# Altium schematic sheet PI485_SAMPLE.SchDoc
size A4
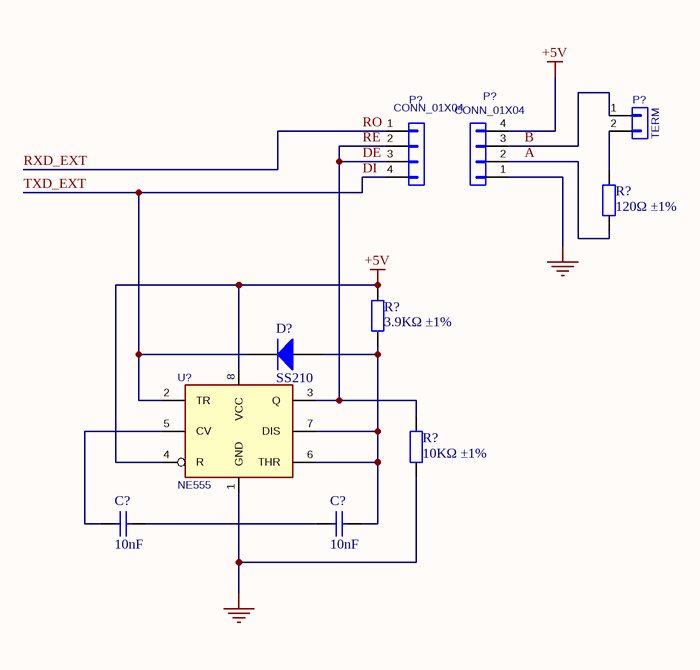
[diagram p0: PI485_SAMPLE.SchDoc]

## Parts
(Parts that share a designator on the sheet are numbered #1, #2 ... from top to bottom, then left to right.)
C?#1  10nF  [0402_C]
C?#2  10nF  [0402_C]
D?  SS210  [SMA(DO-214AC)_S1]
P?#1  TERM  [Pin_Header_Straight_1x02]
P?#2  CONN_01X04  [HDR1X4]
P?#3  CONN_01X04  [HDR1X4]
R?#1  120Ω ±1%  [0402_R]
R?#2  3.9KΩ ±1%  [0402_R]
R?#3  10KΩ ±1%  [0402_R]
U?  value NE555  [SOIC-8_150mil]  (hidden comment: NE555DR)

## Nets
+5V: P?#3.4(P4) R?#2.2 U?.4(R) U?.8(VCC)
GND: P?#3.1(P1) R?#3.1 U?.1(GND)
A: P?#3.2(P2) R?#1.1
B: P?#1.1(P1) P?#3.3(P3)
DE: P?#2.2(P2) P?#2.3(P3) R?#3.2 U?.3(Q)  [also labelled RE]
DI: D?.2(K) P?#2.4(P4) U?.2(TR)  [also labelled TXD_EXT]
RO: P?#2.1(P1)  [also labelled RXD_EXT]
NetC?#1_1: C?#1.1 U?.5(CV)
NetC?#1_2: C?#1.2 C?#2.1
NetC?#2_2: C?#2.2 D?.1(A) R?#2.1 U?.6(THR) U?.7(DIS)
NetP?#1_2: P?#1.2(P2) R?#1.2

## Library data of the parts
C?#1 C?#2 = 0402 10nF (103) 10% 50V: Chip capacitors; Manufacturer: Samsung Electro-Mechanics; PartNumber: CL05B103KB5NNNC; Tolerance: 10%; Voltage: 50V; ComponentLink1Description: Supplier link; ComponentLink1URL: http://www.szlcsc.com/product/details_15869.html; Package: 0402; Supplier: LC; SuppliersPartNumber: C15195; Capacitance: 10nF
D? = SMA(DO-214AC) SS210: 二极管; ComponentLink1Description: 供应商链接; ComponentLink1URL: http://www.szlcsc.com/product/details_15669.html; Package: SMA(DO-214AC); Supplier: LC; SuppliersPartNumber: C14996
P?#1 = CONN_01X02: Value: TERM; Footprint: Pin_Headers:Pin_Header_Straight_1x02
R?#1 = 0402 120R (1200) 1%: Chip resistor; Manufacturer: Uniroyal Elec; PartNumber: 0402WGF1200TCE; Power: 1/16W; ComponentLink1Description: Supplier link; ComponentLink1URL: http://www.szlcsc.com/product/details_25822.html; Package: 0402; Supplier: LC; SuppliersPartNumber: C25079; Resistance: 120Ω; Tolerance: 1%
R?#2 = 0402 3.9K (3901) 1%: Chip resistor; Manufacturer: Uniroyal Elec; PartNumber: 0402WGF3901TCE; Power: 1/16W; ComponentLink1Description: Supplier link; ComponentLink1URL: http://www.szlcsc.com/product/details_52734.html; Package: 0402; Supplier: LC; SuppliersPartNumber: C51721; Resistance: 3.9KΩ; Tolerance: 1%
R?#3 = 0402 10K (1002) 1%: Chip resistor; Manufacturer: Uniroyal Elec; PartNumber: 0402WGF1002TCE; Power: 1/16W; ComponentLink1Description: Supplier link; ComponentLink1URL: http://www.szlcsc.com/product/details_26487.html; Package: 0402; Supplier: LC; SuppliersPartNumber: C25744; Resistance: 10KΩ; Tolerance: 1%
U? = NE555: SuppliersPartNumber: C7593; Supplier: LC
P?#2 P?#3 = CONN_01X04: Value: CONN_01X04; Footprint: Socket_Strips:Socket_Strip_Straight_1x04